# Altium schematic sheet 01-MCU-V2.3.SchDoc
size A4; Organization: Protel International P/L; Address1: L3, 12a Rodborough Rd; Address2: Frenchs Forest; Address3: NSW; Address4: Australia 2086
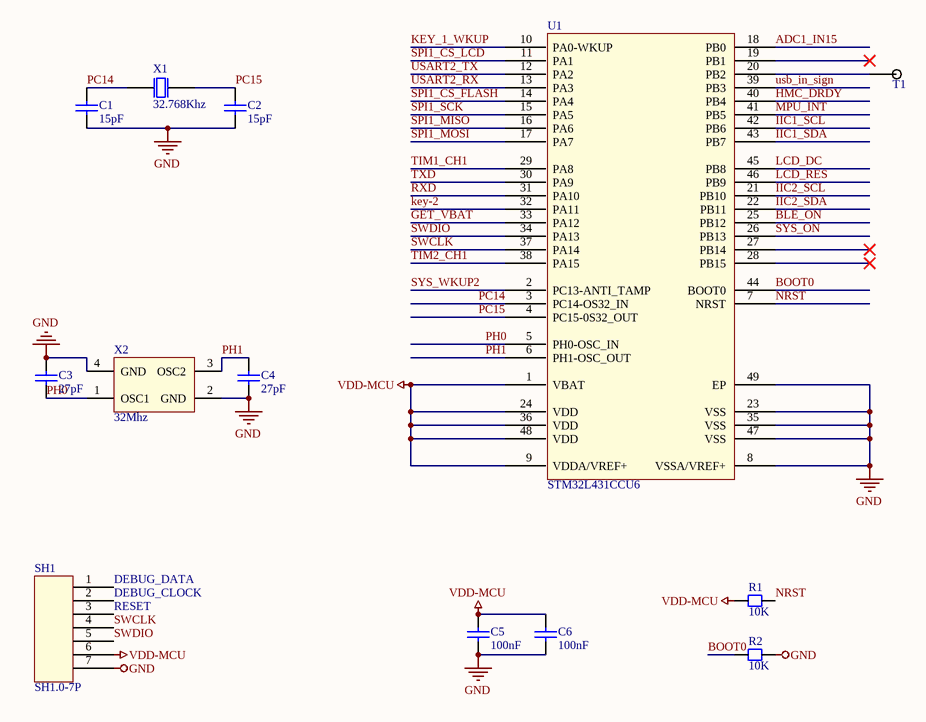
[diagram p0: 01-MCU-V2.3.SchDoc]

## Parts
C1  15pF  [CC1005-0402]
C2  15pF  [CC1005-0402]
C3  27pF  [CC1005-0402]
C4  27pF  [CC1005-0402]
C5  100nF  [CC1005-0402]
C6  100nF  [CC1005-0402]
R1  10K  [CR1005-0402]
R2  10K  [CR1005-0402]
SH1  SH1.0-7P  [SH1.0-7P]
T1  测试点  [测试点]  (value not drawn)
U1  STM32L431CCU6  [STM32-UFQFPN48_N]
X1  32.768Khz  [XTAL-2012]
X2  32Mhz  [XTAL-2016]

## Nets
GND: C1.1 C2.1 C3.2 C4.1 C5.1 C6.1 R2.1 SH1.7 U1.8(VSSA/VREF+) U1.23(VSS) U1.35(VSS) U1.47(VSS) U1.49(EP) X2.2(GND) X2.4(GND)
VDD-MCU: C5.2 C6.2 R1.2 SH1.6 U1.1(VBAT) U1.9(VDDA/VREF+) U1.24(VDD) U1.36(VDD) U1.48(VDD)
ADC1_IN15: U1.18(PB0)
BLE_ON: U1.25(PB12)
BOOT0: R2.2 U1.44(BOOT0)
DEBUG_CLOCK: SH1.2
DEBUG_DATA: SH1.1
GET_VBAT: U1.33(PA12)
HMC_DRDY: U1.40(PB4)
IIC1_SCL: U1.42(PB6)
IIC1_SDA: U1.43(PB7)
IIC2_SCL: U1.21(PB10)
IIC2_SDA: U1.22(PB11)
key-2: U1.32(PA11)
KEY_1_WKUP: U1.10(PA0-WKUP)
LCD_DC: U1.45(PB8)
LCD_RES: U1.46(PB9)
MPU_INT: U1.41(PB5)
NRST: R1.1 U1.7(NRST)
PC14: C1.2 U1.3(PC14-OS32_IN) X1.2
PC15: C2.2 U1.4(PC15-0S32_OUT) X1.1
PH0: C3.1 U1.5(PH0-OSC_IN) X2.1(OSC1)
PH1: C4.2 U1.6(PH1-OSC_OUT) X2.3(OSC2)
RESET: SH1.3
RXD: U1.31(PA10)
SPI1_CS_FLASH: U1.14(PA4)
SPI1_CS_LCD: U1.11(PA1)
SPI1_MISO: U1.16(PA6)
SPI1_MOSI: U1.17(PA7)
SPI1_SCK: U1.15(PA5)
SWCLK: SH1.4 U1.37(PA14)
SWDIO: SH1.5 U1.34(PA13)
SYS_ON: U1.26(PB13)
SYS_WKUP2: U1.2(PC13-ANTI_TAMP)
TIM1_CH1: U1.29(PA8)
TIM2_CH1: U1.38(PA15)
TXD: U1.30(PA9)
USART2_RX: U1.13(PA3)
USART2_TX: U1.12(PA2)
usb_in_sign: U1.39(PB3)
NetT1_1: T1.1 U1.20(PB2)

Not connected (* = marked no-connect by the designer): U1 19(PB1)* 27(PB14)* 28(PB15)*

## Notes on the sheet
- Title
- Size:
- Date:
- A4
- Number:
- Time:
- Revision:
- Sheet
- of
- File:

## Library data of the parts
C1-C6 = Chip capacitor: 贴片电容
R1 R2 = Chip resistor: 贴片电阻
SH1 = SH1.0-7P: 间距为1mm的端子
U1 = STM32L431CCU6: stm32低功耗单片机 主频80MHz
X1 = XTAL 2012: 2012封装的时钟晶振
X2 = XTAL 2016: 2016封装的晶振